# EasyEDA Pro project stm32-motordrive.epro, board PCB2
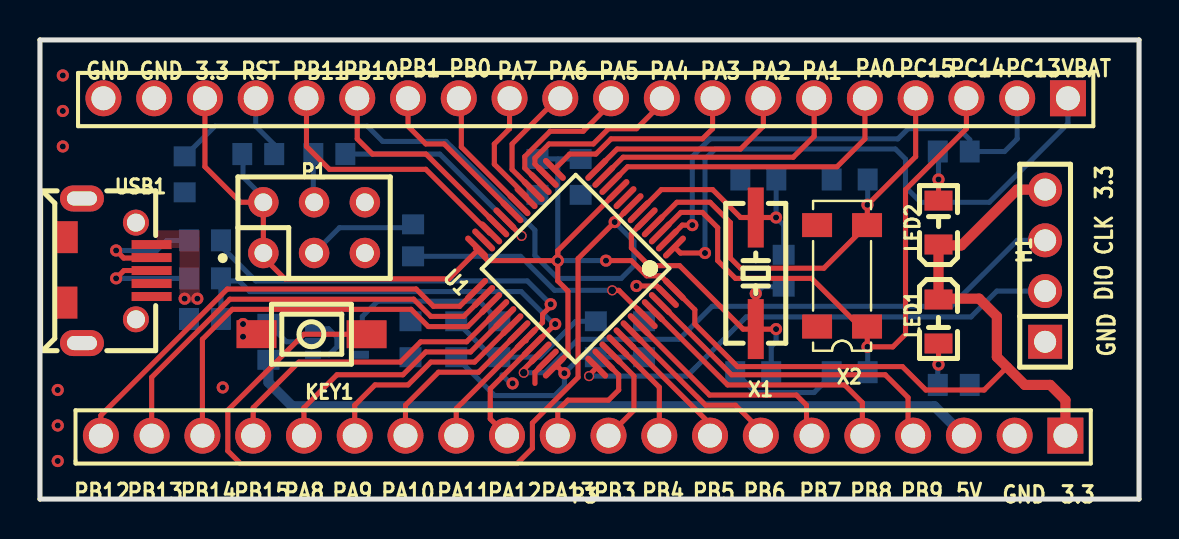
[diagram p5: board, top side]
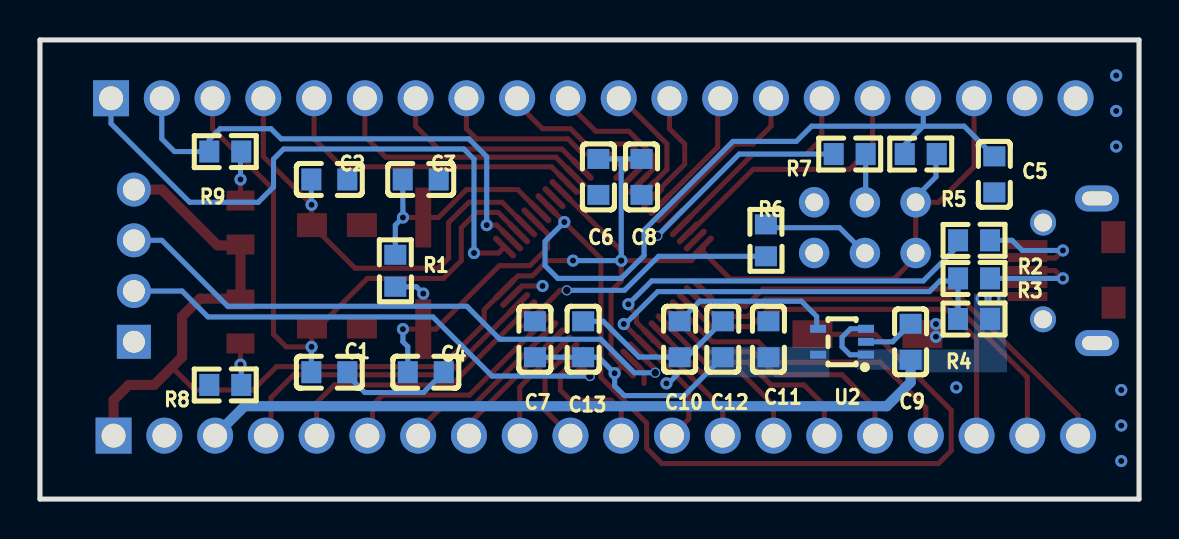
[diagram p6: board, bottom side, seen from below]

Outline 54.99 x 22.99 mm; copper layers: Top Layer, Bottom Layer. Coordinates in mm from the lower left corner of the outline.
Outline path: 0,22.99 54.99,22.99 54.99,0 0,0 0,22.99
Stack: Top Layer 0.035mm / Dielectric1 1.51mm FR4 er 4.5 / Bottom Layer 0.035mm

## Design rules (mm)
template: JLCPCB Capability(Two Layers Board)
spacing copperThickness1oz (default): track to track 0.102, other pairs 0.152 to 0.3
spacing copperThickness2oz: track to track 0.203, other pairs 0.152 to 0.3
track width copperThickness1oz (default): min 0.127, default 0.254, max 2.54
track width copperThickness2oz: min 0.203, default 0.254, max 2.54
differential pair differentialPair (default): width min 0.127, default 0.254, max 2.54; gap min 0.152, default 0.152
via viaSize (default): diameter min 0.5, default 0.61, max 10; hole min 0.3, default 0.305, max 6.3

## Placement (name value [footprint] x y rotation side)
C1  22P  [C0603]  40.51 6.35 0 bottom
C2  22P  [C0603]  40.51 16 0 bottom
C3  22P  [C0603]  35.94 16 0 bottom
C4  22P  [C0603]  35.69 6.35 0 bottom
C5  104  [C0603]  7.24 16.26 270 bottom
C6  104  [C0603]  27.05 16.13 270 bottom
C7  104  [C0603]  30.23 8 90 bottom
C8  104  [C0603]  24.89 16.13 270 bottom
C9  105  [C0603]  11.43 7.87 90 bottom
C10  223  [C0603]  22.99 8 270 bottom
C11  104  [C0603]  18.54 8 90 bottom
C12  106  [C0603]  20.83 8 90 bottom
C13  104  [C0603]  27.81 8 90 bottom
H1  220S-1*4P H=8.5MM Ytype Gold-plated  [DIP-1X4P2.54]  50.29 11.68 90 top
KEY1  Switch3x4x2  [KEY-3.0*4.0]  13.59 8.25 0 top
LED1  204-10SURD/S530-A3  [LED0805-RD]  44.96 8.89 270 top
LED2  204-10SURD/S530-A3  [LED0805-RD]  44.96 13.84 90 top
P1  HDR-IDC-2.54-2X3P  [HEADER_PRG_2X3]  13.72 13.59 0 top
P2  Header-Female-2.54_1x20  [HDR-TH_20P-P2.54-V]  27.31 20.07 180 top
P3  Header-Female-2.54_1x20  [HDR-TH_20P-P2.54-V]  27.18 3.17 180 top
R1  1M  [R0603]  37.21 11.43 90 bottom
R2  20R  [R0603]  8.25 12.95 180 bottom
R3  20R  [R0603]  8.25 11.05 180 bottom
R4  4.7k  [R0603]  8.25 9.02 180 bottom
R5  10k  [R0603]  10.92 17.27 0 bottom
R6  10k  [R0603]  18.67 12.95 90 bottom
R7  10k  [R0603]  14.48 17.27 0 bottom
R8  510R  [R0603]  45.72 5.71 180 bottom
R9  510R  [R0603]  45.72 17.4 180 bottom
U1  STM32F103C8T6  [LQFP-48_L7.0-W7.0-P0.50-LS9.0-BL]  26.8 11.56 135 top
U2  RT9193-33GU5  [SC-70-5_L2.1-W1.3-P0.65-LS2.1-BL]  14.86 7.87 270 bottom
USB1  micro USBFemale  [MICRO-USB-SMD_5P-P0.65-H-F_C10418]  3.43 11.43 270 top
X1  8MHz  [HC-49-SMD_L7.0-W3.0]  35.81 11.3 90 top
X2  32.768KHz  [CRYSTAL_SMD_SEIKOEPSON_MC156-4PIN_7.1X2.5MM]  40.13 11.18 90 top

## Footprints (pads in the part's own frame, mm; a bottom-side part is the same pattern mirrored in y, then rotated)
C0603
  rect 1x1.1 smd: 1(0.9,0) 2(-0.9,0)
CRYSTAL_SMD_SEIKOEPSON_MC156-4PIN_7.1X2.5MM
  rect 1.2x1.5 smd: 1(-2.54,-1.25) 2(2.54,-1.25) 3(2.54,1.25) 4(-2.54,1.25)
DIP-1X4P2.54
  rect 1.7x1.7 hole 1.1: 1(-3.81,0)
  round 1.7 hole 1.1: 2(-1.27,0) 3(1.27,0) 4(3.81,0)
HC-49-SMD_L7.0-W3.0
  rect 3x0.8 smd: 1(-2.794,0) 2(2.794,0)
HDR-TH_20P-P2.54-V
  rect 1.8x1.8 hole 1.2: 1(-24.13,0)
  round 1.8 hole 1.2: 2(-21.59,0) 3(-19.05,0) 4(-16.51,0) 5(-13.97,0) 6(-11.43,0) 7(-8.89,0) 8(-6.35,0) 9(-3.81,0) 10(-1.27,0) 11(1.27,0) 12(3.81,0) 13(6.35,0) 14(8.89,0) 15(11.43,0) 16(13.97,0) 17(16.51,0) 18(19.05,0) 19(21.59,0) 20(24.13,0)
HEADER_PRG_2X3
  round 1.524 hole 0.889: 1(-2.54,-1.27) 2(-2.54,1.27) 3(0,-1.27) 4(0,1.27) 5(2.54,-1.27) 6(2.54,1.27)
KEY-3.0*4.0
  rect 2x1.4 smd: 1(-2.752,0.001) 2(2.752,-0.001)
LED0805-RD
  rect 1x1.4 smd: 1(-1.1,0) 2(1.1,0)
LQFP-48_L7.0-W7.0-P0.50-LS9.0-BL
  oval 0.3x1.5 smd: 1(-2.75,-4.25) 2(-2.25,-4.25) 3(-1.75,-4.25) 4(-1.25,-4.25) 5(-0.75,-4.25) 6(-0.25,-4.25) 7(0.25,-4.25) 8(0.75,-4.25) 9(1.25,-4.25) 10(1.75,-4.25) 11(2.25,-4.25) 12(2.75,-4.25) 25(2.75,4.25) 26(2.25,4.25) 27(1.75,4.25) 28(1.25,4.25) 29(0.75,4.25) 30(0.25,4.25) 31(-0.25,4.25) 32(-0.75,4.25) 33(-1.25,4.25) 34(-1.75,4.25) 35(-2.25,4.25) 36(-2.75,4.25)
  oval 1.5x0.3 smd: 13(4.25,-2.75) 14(4.25,-2.25) 15(4.25,-1.75) 16(4.25,-1.25) 17(4.25,-0.75) 18(4.25,-0.25) 19(4.25,0.25) 20(4.25,0.75) 21(4.25,1.25) 22(4.25,1.75) 23(4.25,2.25) 24(4.25,2.75) 37(-4.25,2.75) 38(-4.25,2.25) 39(-4.25,1.75) 40(-4.25,1.25) 41(-4.25,0.75) 42(-4.25,0.25) 43(-4.25,-0.25) 44(-4.25,-0.75) 45(-4.25,-1.25) 46(-4.25,-1.75) 47(-4.25,-2.25) 48(-4.25,-2.75)
MICRO-USB-SMD_5P-P0.65-H-F_C10418
  oval 1.3x2.2 hole 0.7x1.5: 0(-3.619,-1.329) 0(3.619,-1.329)
  round 1.3 hole 0.9: 0(-2.41,1.371) 0(2.431,1.371)
  rect 1.6x1.2 smd: 0(-1.683,-2.139) 0(1.595,-2.156)
  rect 0.45x2 smd: 1(-1.31,2.156) 2(-0.66,2.156) 3(-0.011,2.156) 4(0.639,2.156) 5(1.29,2.156)
R0603
  rect 1x1.1 smd: 1(0.8,0) 2(-0.8,0)
SC-70-5_L2.1-W1.3-P0.65-LS2.1-BL
  rect 0.4x0.8 smd: 1(0.65,1.2) 2(0,1.2) 3(-0.65,1.2) 4(-0.65,-1.2) 5(0.65,-1.2)

## Nets
As in the schematic.

Pads without a net: X2 3 4

## Via types
v1: diameter 0.61, hole 0.305, Top Layer to Bottom Layer, 31 vias
v2: diameter 0.508, hole 0.381, Top Layer to Bottom Layer, 4 vias

## Routing (per net, layer and track width the routed paths; a pad name or vN(x,y) marks a point on that pad's centre or on a via; arc(x,y) is an arc through that point)
5V: length 40.3
  Bottom Layer w0.254: 13.66,7.22 14.46,7.22 14.86,7.62 14.86,8.1 14.44,8.52 13.66,8.52
  Bottom Layer w0.508: C9.2 11.43,5.84 12.62,4.65 44.75,4.65 P3.3
  vias: v1(7.24,10.03) v1(7.87,10.03)
GND: length 20.6
  Top Layer w0.254: 29.97,10.67 30.87,10.67 U1.47 ; 24.76,5.79 24.76,6.34 25.38,6.96
  Bottom Layer w0.254: 27.81,8.9 26.81,8.9 25.02,7.11 22.99,7.1 22.63,7.1 C12.1 ; 34.79,6.35 35.8,5.33 38.73,5.33 39.61,6.21 C1.2 ; C9.1 12.33,7.87 U2.2 ; 23.11,6.22 23.55,5.79 v1(23.65,5.79)
  vias: v1(0.89,5.46) v1(0.89,3.68) v1(0.89,1.91) v1(1.14,21.21) v1(1.14,19.43) v1(1.14,17.65) v1(9.14,5.59) v1(10.16,8.76) v1(10.16,8.13) v1(29.84,10.67)
VBAT: length 29.5
  Top Layer w0.254: U1.1 32.05,12.32 v1(33.27,12.32)
  Bottom Layer w0.254: P2.1 51.44,18.8 47.5,14.86 44.07,14.86 43.31,15.62 43.31,17.02 42.8,17.53 33.78,17.53 33.27,17.02 v1(33.27,12.32)
VCC3.3: length 105.5
  Top Layer w0.254: 21.84,12.41 20.46,11.02 12.26,11.02 11.17,12.11 ; 25.74,6.61 26.42,7.29 26.42,10.41 25.91,10.92 v1(25.91,11.94) ; 31.84,10.4 31.07,11.18 30.35,11.18 29.59,11.94 v1(28.32,11.94) ; U1.48 32.77,9.48 32.77,8.76 34.9,6.63 43.15,6.63 44.32,5.46 47.24,5.46 48.37,6.59 48.4,6.59 ; v1(25.91,11.94) 25.91,12.44 U1.9 ; v1(25.91,11.94) 22.41,11.94 21.79,12.56 ; U1.36 25.93,6.61 v1(26.24,6.3) ; P2.18 8.25,16.64 10.03,14.86 11.18,14.86 11.18,12.45
  Top Layer w0.508: P3.1 51.31,4.95 50.55,5.71 49.28,5.71 47.88,7.11 47.88,9.14 46.99,10.03 45,10.03 LED1.1 LED2.1 45,12.7 46.1,12.7 48.9,15.49 H1.4
  Bottom Layer w0.254: 11.18,14.86 11.18,15.11 10.16,16.13 10.16,17.23 R5.2 ; 25.91,17.03 v1(25.91,11.94) v1(28.32,11.94) ; 27.81,7.1 30.23,7.1 ; 27.81,7.1 27.04,7.1 26.24,6.3 26.24,5.67 25.76,5.18 22.75,5.18 20.83,7.1 ; 27.81,7.1 27.81,7.49 ; C8.2 C6.2
BOOT0: length 12.9
  Top Layer w0.254: v2(28.63,10.45) 28.97,10.45 30.34,9.08
  Bottom Layer w0.254: v2(28.63,10.45) 25.75,10.45 24.04,12.15 R6.2
BOOT1: length 11.7
  Top Layer w0.254: v2(24.1,13.18) 23.27,14.01 23.27,14.03
  Bottom Layer w0.254: 15.28,17.27 20,17.27 v2(24.1,13.18)
LED1_2: length 2.1
  Top Layer w0.254: LED1.2 v1(44.96,6.73)
  Bottom Layer w0.254: R8.1 44.92,6.69 v1(44.96,6.73)
LED2_2: length 2.5
  Top Layer w0.254: LED2.2 v1(44.96,16)
  Bottom Layer w0.254: R9.1 44.96,17.36 v1(44.96,16)
OSCIN: length 16.3
  Top Layer w0.254: X1.1 v1(36.83,8.51) ; X1.1 v1(35.81,10.29) ; X1.1 35.18,8.51 32,11.68 30.48,11.68 29.59,12.57 29.59,13.29 30.33,14.03
  Bottom Layer w0.254: R1.2 36.16,10.63 v1(35.81,10.29) ; v1(36.83,8.51) 36.83,7.87 36.59,7.63 C4.1
OSCOUT: length 11.8
  Top Layer w0.254: U1.6 31.09,15.49 33.66,15.49 35.05,14.1 X1.2 v1(36.83,14.1)
  Bottom Layer w0.254: C3.1 v1(36.83,14.1) 37.21,13.72 R1.1
P1_3: length 5.6
  Bottom Layer w0.254: R6.1 18.67,13.59 14.99,13.59 P1.3
P1_4: length 2.4
  Bottom Layer w0.254: R7.2 13.68,14.9 P1.4
PA0: length 15.7
  Top Layer w0.254: P2.5 41.28,18.03 39.88,16.64 29.4,16.64 28.56,15.8
PA1: length 13.3
  Top Layer w0.254: P2.6 38.73,18.16 37.69,17.12 29.18,17.12 28.21,16.15
PA2: length 10.6
  Top Layer w0.254: U1.12 28.88,17.53 35.05,17.53 36.19,18.67 P2.7
PA3: length 10.3
  Top Layer w0.254: U1.13 26.5,17.27 27.81,17.27 28.57,18.03 33.15,18.03 33.66,18.54 P2.8
PA4: length 8.9
  Top Layer w0.254: U1.14 24.76,16.77 24.76,17.08 25.47,17.78 27.69,17.78 28.45,18.54 29.84,18.54 31.12,19.81 P2.9
PA5: length 7.3
  Top Layer w0.254: P2.10 28.57,19.81 27.18,18.41 25.53,18.41 24.26,17.14 24.26,16.57 U1.15
PA6: length 6.1
  Top Layer w0.254: P2.11 25.91,20.07 23.62,17.78 23.62,16.5 24.68,15.45
PA7: length 5.9
  Top Layer w0.254: P2.12 23.5,18.54 22.73,17.78 22.73,16.76 24.32,15.17 U1.17
PA8: length 13.3
  Top Layer w0.254: U1.29 21.54,7.37 19.3,7.37 18.16,6.22 14.86,6.22 13.21,4.57 P3.16
PA9: length 11.1
  Top Layer w0.254: U1.30 21.75,6.86 19.56,6.86 18.41,5.71 16.76,5.71 15.75,4.7 P3.15
PA10: length 8.7
  Top Layer w0.254: P3.14 18.29,4.7 19.94,6.35 21.94,6.35 23.97,8.38
PA11: length 26.6
  Top Layer w0.254: P3.13 20.83,4.53 24.32,8.02 ; v1(25.55,9.75) 25.55,9.66 25.15,9.25 25.15,8.84 U1.32 24.32,7.92
  Bottom Layer w0.254: v1(25.55,9.75) 24.38,10.92 10.79,10.92 9.05,12.66 R2.2
PA12: length 27
  Top Layer w0.254: 24.68,7.67 v1(25.78,8.76) ; U1.33 22.53,5.52 22.53,4.01 P3.12
  Bottom Layer w0.254: R3.2 R4.2 ; 25.83,8.64 24.08,10.39 10.49,10.39 9.96,10.92 9.11,10.92
PA13: length 30.2
  Top Layer w0.254: v2(24.21,6.32) 24.21,6.49 25.02,7.3
  Bottom Layer w0.254: v2(24.21,6.32) 25.25,6.32 26.92,8 31.98,8 33.63,9.65 45.59,9.65 48.9,12.95 H1.3
PA14: length 25.2
  Top Layer w0.254: 27.87,6.6 27.47,6.21 v2(27.47,6.16)
  Bottom Layer w0.254: v2(27.47,6.16) 32.37,6.16 35.33,9.12 46.58,9.12 47.88,10.41 H1.2
PA15: length 6.5
  Top Layer w0.254: 28.21,6.96 28.96,6.22 28.96,5.46 28.45,4.95 26.42,4.95 25.91,4.44 P3.11
PB0: length 6.6
  Top Layer w0.254: U1.18 21.08,17.63 21.08,19.94 P2.13
PB1: length 8.4
  Top Layer w0.254: P2.14 18.41,18.67 19.3,17.78 20.22,17.78 U1.19
PB3: length 5.1
  Top Layer w0.254: U1.39 29.72,6.16 29.72,4.44 P3.10
PB4: length 5.4
  Top Layer w0.254: U1.40 30.99,5.6 P3.9
PB5: length 6.6
  Top Layer w0.254: P3.8 33.53,3.77 29.27,8.02
PB6: length 8.7
  Top Layer w0.254: P3.7 35.94,3.3 35.94,3.56 34.8,4.7 33.3,4.7 29.63,8.37
PB7: length 11.7
  Top Layer w0.254: P3.6 38.35,3.43 38.35,4.7 37.85,5.21 33.5,5.21 U1.43
PB8: length 14
  Top Layer w0.254: P3.5 41.15,4.83 40.26,5.71 34.41,5.71 30.69,9.44
PB9: length 16.4
  Top Layer w0.254: P3.4 43.43,3.43 43.43,5.08 42.29,6.22 34.61,6.22 U1.46
PB10: length 10.9
  Top Layer w0.254: 22.91,13.68 19.31,17.27 16.64,17.27 15.88,18.03 P2.15
PB11: length 13.4
  Top Layer w0.254: U1.22 22.49,13.32 19.3,16.51 14.48,16.51 13.34,17.65 P2.16
PB12: length 23.1
  Top Layer w0.254: U1.25 21,9.65 19.69,9.65 18.82,10.52 9.37,10.52 3.05,4.19 P3.20
PB13: length 21.9
  Top Layer w0.254: U1.26 21.2,9.14 19.56,9.14 18.69,10.01 9.5,10.01 5.59,6.1 P3.19
PB14: length 20.7
  Top Layer w0.254: U1.27 21.4,8.64 19.43,8.64 18.57,9.5 9.63,9.5 8.13,8 P3.18
PB15: length 15.7
  Top Layer w0.254: P3.17 10.67,4.57 12.95,6.86 18.03,6.86 19.05,7.87 21.35,7.87 22.91,9.44
PC13: length 24.9
  Top Layer w0.254: v1(32.64,13.72) 32.14,13.72 31.39,12.97
  Bottom Layer w0.254: P2.2 48.9,18.03 48.26,17.4 R9.2 46.52,18 45.97,18.54 43.43,18.54 42.93,18.03 33.53,18.03 32.64,17.14 v1(32.64,13.72)
PC14: length 31.6
  Top Layer w0.254: 31.04,13.32 32.06,14.35 33.15,14.35 33.91,13.59 33.91,11.94 34.8,11.05 38.61,11.05 41.02,8.64 X2.1 v1(41.4,7.62) 42.67,7.62 43.31,8.25 43.31,15.49 46.35,18.54 P2.3
  Bottom Layer w0.254: C1.1 41.41,7.61 v1(41.4,7.62)
PC15: length 23.1
  Top Layer w0.254: P2.4 43.81,17.14 v1(41.4,14.73) X2.2 39.22,11.56 35.05,11.56 34.54,12.06 34.54,13.84 33.53,14.86 31.87,14.86 30.69,13.68
  Bottom Layer w0.254: v1(41.4,14.73) 41.41,14.74 C2.1
RESET: length 74.2
  Top Layer w0.254: 16.34,8.25 16.26,8.76 ; 16.34,8.25 13.2,8.25 9.4,4.44 9.4,2.41 10.03,1.78 23.88,1.78 24.64,2.54 24.64,3.81 26.92,6.1 26.92,12.04 v1(28.76,13.87) U1.7
  Bottom Layer w0.254: R5.1 11.72,17.74 10.79,18.67 ; 10.79,18.67 16.38,18.67 17.15,17.91 20.32,17.91 24.76,13.46 24.76,12.19 25.91,11.05 29.08,11.05 29.72,11.68 29.72,12.91 v1(28.75,13.87) ; 10.79,18.67 P2.17 ; 10.79,18.67 8.75,18.67 C5.2
U2_4: length 8.2
  Bottom Layer w0.254: 22.99,8.9 21.98,9.91 16.89,9.91 16.13,9.14 16.13,8.59 16.06,8.52
USB1_2: length 5.8
  Top Layer w0.254: USB1.2 5.56,12.06 4.19,12.06 v1(3.81,12.45)
  Bottom Layer w0.254: R2.1 6.35,12.95 5.84,12.45 v1(3.81,12.45)
USB1_3: length 5.6
  Top Layer w0.254: USB1.3 4.2,11.44 v1(3.81,11.05)
  Bottom Layer w0.254: v1(3.81,11.05) R3.1

## Copper pours and planes (outline as drawn; the poured copper is in the pictures)
5V on Top Layer: 5.84,13.46 8,13.46 8,12.57 5.84,12.57
5V on Top Layer: 6.98,13.08 8,13.08 8,9.84 6.98,9.84
5V on Bottom Layer: 10.92,7.49 14.1,7.49 14.1,6.48 10.92,6.48
5V on Bottom Layer: 6.6,7.49 10.92,7.49 10.92,6.35 6.6,6.35
5V on Bottom Layer: 6.67,10.29 8.25,10.29 8.25,7.05 6.67,7.05
VCC3.3 on Bottom Layer: 15.49,7.62 21.59,7.62 21.59,6.1 15.49,6.1

## Text on the board
Top Silkscreen Layer: PB12 | GND | PB13 | PB14 | 3.3 | PB15 | RST | PA8 | PB11 | PA9 | PB10 | PA10 | PB1 | PA11 | PB0 | PA12 | PA7 | PA13 | PA6 | PB3 | PA5 | PB4 | PA4 | PB5 | PA3 | PB6 | PA2 | PB7 | PA1 | PB8 | PA0 | PC15 | PB9 | PC14 | 5V | PC13 | VBAT | CLK | DIO
